# EAGLE design pax_counter (EAGLE 9.6.2)
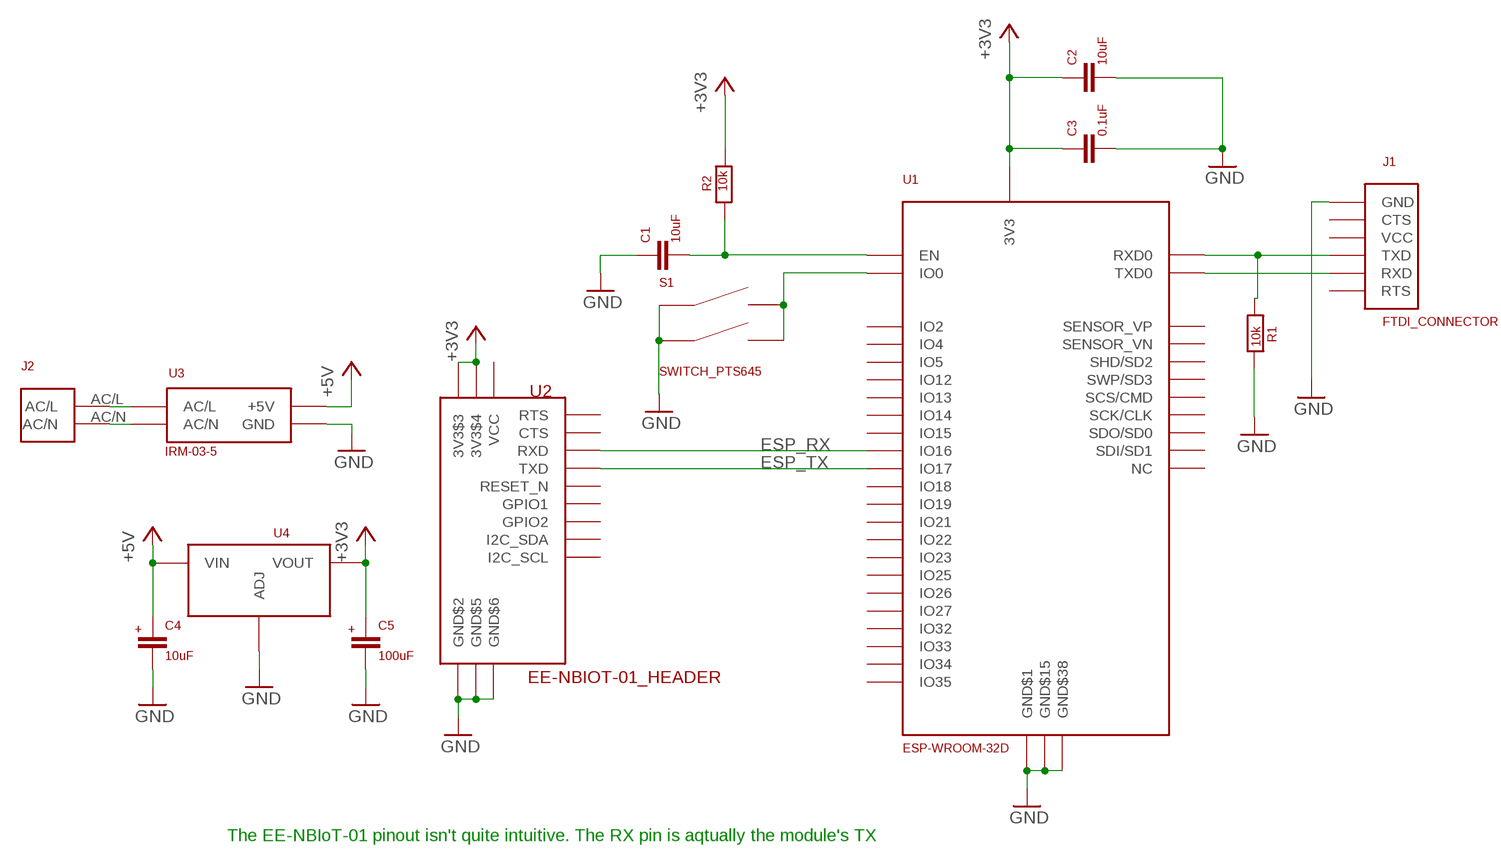
[diagram p0: schematic, sheet 1]

## Parts
C1  10uF  CAPACITOR0402  [CAP_0402]
C2  10uF  CAPACITOR0402  [CAP_0402]
C3  0.1uF  CAPACITOR0402  [CAP_0402]
C4  10uF  TANTALUM_CAPACITOR  [TANTALUM_CAP_1206]
C5  100uF  TANTALUM_CAPACITOR  [TANTALUM_CAP_1206]
J1  FTDI_CONNECTOR  [FTDI_CONNECTOR]
J2  240VAC_SOLDER_CONNECTOR  [240VAC_SOLDER_CONNECTOR]
R1  10k  RESISTOR  [RES_0402]
R2  10k  RESISTOR  [RES_0402]
S1  SWITCH_PTS645  [SWITCH_PTS645_EE_NBIOT_01]
U1  ESP-WROOM-32D  [ESP_WROOM_32D]
U2  EE-NBIOT-01_HEADER  [EE-NBIOT-01_HEADER]
U3  IRM-03-5  [IRM-03-5]
U4  LM1117  [SOT-223]

## Nets
+3V3: C2.P$1 C3.P$1 C5.V+(+) R2.P$2 U1.2(3V3) U2.3V3$3 U2.3V3$4 U4.P$2(VOUT) U4.VOUT$1(VOUT)
+5V: C4.V+(+) U3.+5V U4.VIN
ESP_RX: U1.27(IO16) U2.RXD
ESP_TX: U1.28(IO17) U2.TXD
GND: C1.P$1 C2.P$2 C3.P$2 C4.GND(-) C5.GND(-) J1.GND R1.P$2 S1.A1 S1.A2 U1.1(GND$1) U1.15(GND$15) U1.38(GND$38) U1.GND$39(GND$38) U1.GND$40(GND$38) U1.GND$41(GND$38) U1.GND$42(GND$38) U1.GND$43(GND$38) U1.GND$44(GND$38) U1.GND$45(GND$38) U1.GND$46(GND$38) U1.GND$47(GND$38) U2.GND$2 U2.GND$5 U2.GND$6 U3.GND U4.GND(ADJ)
N$1: J2.AC/L U3.AC/L
N$2: J2.AC/N U3.AC/N
N$3: C1.P$2 R2.P$1 U1.3(EN)
N$4: J1.TXD R1.P$1 U1.34(RXD0)
N$5: J1.RXD U1.35(TXD0)
N$6: S1.B1 S1.B2 U1.25(IO0)
Unconnected: J1.CTS J1.RTS J1.VCC U1.4(SENSOR_VP) U1.5(SENSOR_VN) U1.6(IO34) U1.7(IO35) U1.8(IO32) U1.9(IO33) U1.10(IO25) U1.11(IO26) U1.12(IO27) U1.13(IO14) U1.14(IO12) U1.16(IO13) U1.17(SHD/SD2) U1.18(SWP/SD3) U1.19(SCS/CMD) U1.20(SCK/CLK) U1.21(SDO/SD0) U1.22(SDI/SD1) U1.23(IO15) U1.24(IO2) U1.26(IO4) U1.29(IO5) U1.30(IO18) U1.31(IO19) U1.32(NC) U1.33(IO21) U1.36(IO22) U1.37(IO23) U2.CTS U2.GPIO1 U2.GPIO2 U2.I2C_SCL U2.I2C_SDA U2.RESET_N U2.RTS U2.VCC

## Notes on the sheet
- The EE-NBIoT-01 pinout isn't quite intuitive. The RX pin is aqtually the module's TX

## Library data of the parts
C1-C3 = TimeExpander2:CAPACITOR
C4 C5 = TimeExpander2:TANTALUM_CAPACITOR
J1 = TimeExpander2:FTDI_CONNECTOR
J2 = TimeExpander2:240VAC_SOLDER_CONNECTOR
R1 R2 = TimeExpander2:RESISTOR
S1 = TimeExpander2:SWITCH_PTS645
U1 = TimeExpander2:ESP-WROOM-32D
U2 = TimeExpander2:EE-NBIOT-01_HEADER
U3 = TimeExpander2:IRM-03-5
U4 = TimeExpander2:LM1117

## Board
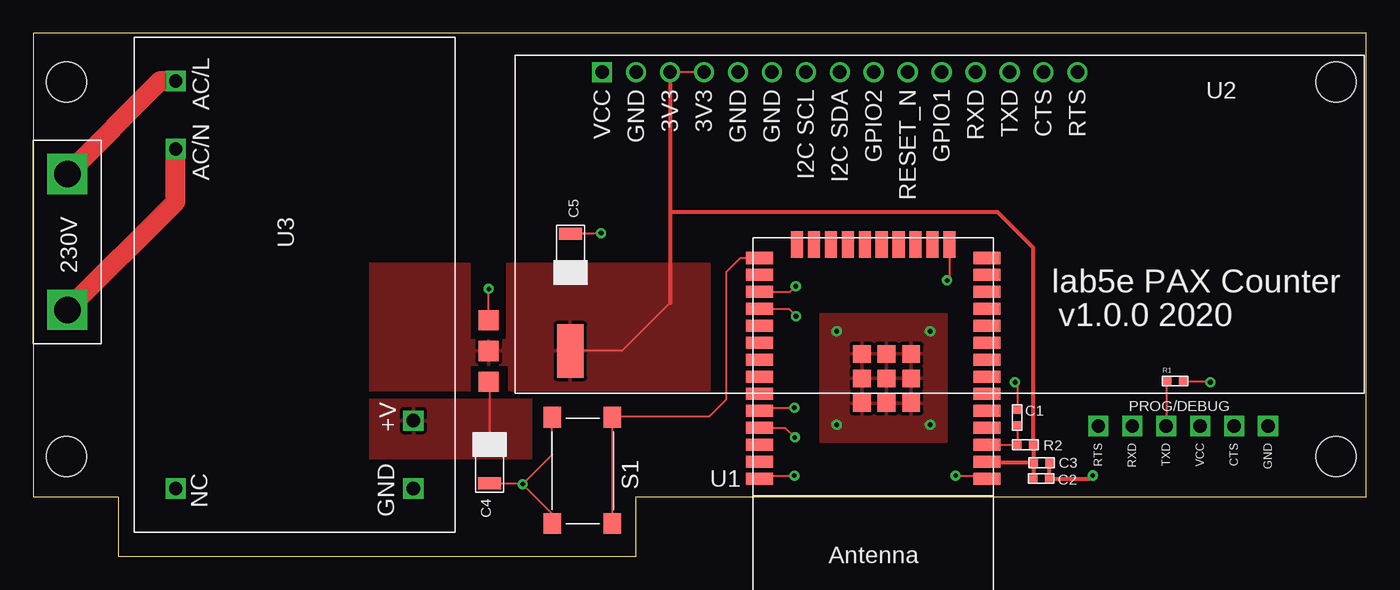
[diagram p1: board, top side]
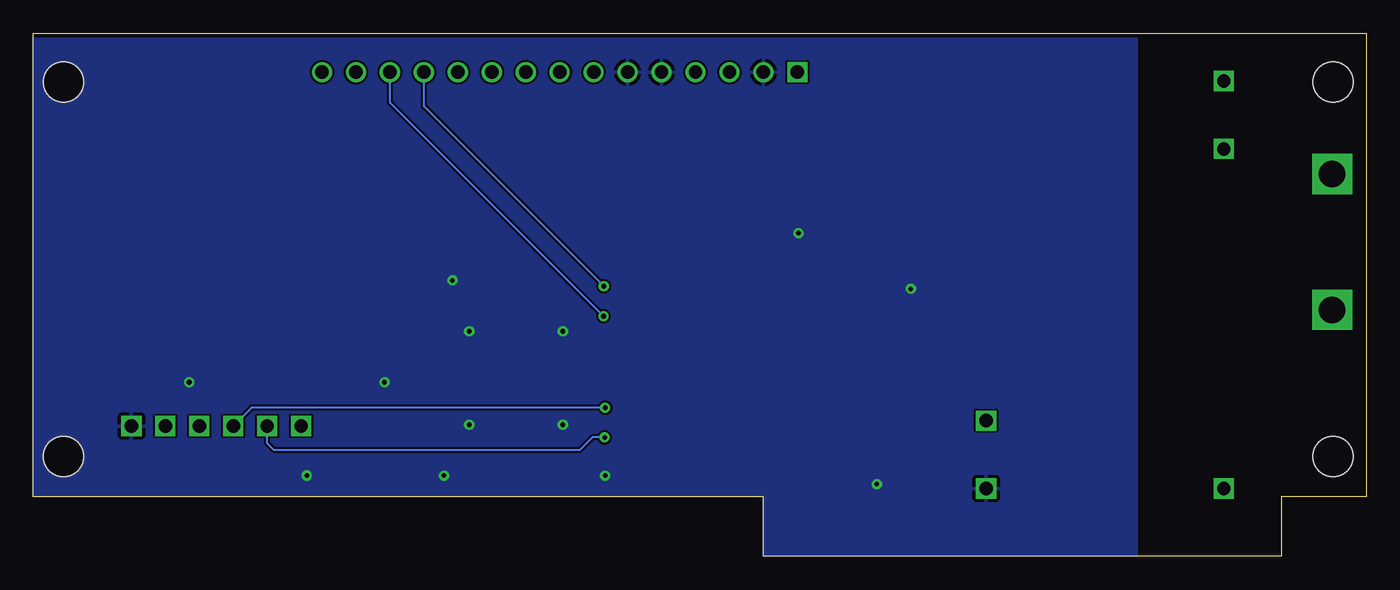
[diagram p2: board, bottom side, seen from below]

Size 99.69 x 39.09 mm. Coordinates in mm from the lower left corner, seen from the top.
Outline: 0,4.44 6.35,4.44 6.35,0 45.08,0 45.08,4.44 99.69,4.44 99.69,39.09 0,39.09 0,4.44
Copper layers (1*16): Top 0.035mm / dielectric 1.5mm / Bottom 0.035mm
Design rules "default *": minimum track width 6mil, minimum drill 0.35mm, track to track 6mil, track to pad 6mil, pad to pad 6mil, via to via 6mil, smd to smd 6mil, copper to edge 0mil, drill to drill 6mil, minimum pad ring 10mil, minimum via ring 8mil, stop-mask expansion 4mil, vias tented up to drill 20mil, thermal gap 10mil
Holes 3 mm at 2.46,7.44 97.46,7.44 2.46,35.45 97.46,35.45

### Footprints (pad centres in the part's own frame; a part is rotated, then mirrored left to right if it is on the bottom)
CAP_0402 = smd 0.635 x 0.61: P$1 0,0; P$2 1.194,0
TANTALUM_CAP_1206 = smd 0.914 x 1.72: GND 0,0; V+ 3.048,0
FTDI_CONNECTOR = drill 1 square: CTS 2.54,0; GND 0,0; RTS 12.7,0; RXD 10.16,0; TXD 7.62,0; VCC 5.08,0
240VAC_SOLDER_CONNECTOR = drill 2 square: AC/L 0,0; AC/N 10.16,0
RES_0402 = smd 0.635 x 0.61: P$1 0,0; P$2 1.194,0
SWITCH_PTS645_EE_NBIOT_01 = smd 1.55 x 1.3: A1 0,0; A2 7.95,0; B1 0,-4.5; B2 7.95,-4.5
ESP_WROOM_32D = smd 2 x 0.9: 1 0,16.51; 2 0,15.24; 3 0,13.97; 4 0,12.7; 5 0,11.43; 6 0,10.16; 7 0,8.89; 8 0,7.62; 9 0,6.35; 10 0,5.08; 11 0,3.81; 12 0,2.54; 13 0,1.27; 14 0,0; 25 17,0; 26 17,1.27; 27 17,2.54; 28 17,3.81; 29 17,5.08; 30 17,6.35; 31 17,7.62; 32 17,8.89; 33 17,10.16; 34 17,11.43; 35 17,12.7; 36 17,13.97; 37 17,15.24; 38 17,16.51 | smd 0.9 x 2: 15 2.785,-1; 16 4.055,-1; 17 5.325,-1; 18 6.595,-1; 19 7.865,-1; 20 9.135,-1; 21 10.405,-1; 22 11.675,-1; 23 12.945,-1; 24 14.215,-1 | smd 1.33 x 1.33: GND$39 5.665,10.845; GND$40 7.5,10.845; GND$41 9.335,10.845; GND$42 5.665,9.01; GND$43 7.5,9.01; GND$44 9.335,9.01; GND$45 5.665,7.175; GND$46 7.5,7.175; GND$47 9.335,7.175
EE-NBIOT-01_HEADER = drill 1: 3V3$3 0,5.08; 3V3$4 0,7.62; CTS 0,33.02; GND$2 0,2.54; GND$5 0,10.16; GND$6 0,12.7; GPIO1 0,25.4; GPIO2 0,20.32; I2C_SCL 0,15.24; I2C_SDA 0,17.78; RESET_N 0,22.86; RTS 0,35.56; RXD 0,27.94; TXD 0,30.48 | drill 1 square: VCC 0,0
IRM-03-5 = drill 1 square: +5V 25.4,17.78; AC/L 0,0; AC/N 5.08,0; GND 30.48,17.78; NC 30.48,0
SOT-223 = smd 1.5 x 1.5: GND -2.3,-6.1; P$2 0,-6.1; VIN 2.3,-6.1 | smd 4 x 2: VOUT$1 0,0

### Placement (x,y rotation side)
C1  73.6,10.97 270 top
C2  74.79,5.8 0 top
C3  74.82,6.98 0 top
C4  34.11,5.45 90 top
C5  40.18,24.1 270 top
J1  92.37,9.73 180 top
J2  2.54,28.57 270 top
R1  84.8,13.09 0 top
R2  73.61,8.33 0 top
S1  38.81,2.44 90 top
U1  71.32,22.3 180 top
U2  42.55,36.2 270 top
U3  10.64,35.53 270 top
U4  40.16,15.34 270 top

### Tracks (layer width: path | path; a pad name or v marks a point on that pad's centre or on a via)
+3V3
  Top 0.152: U4.VOUT$1 44.02,15.34 47.62,18.95 | 71.39,6.98 U1.2 | 74.82,5.83 C2.P$1 | R2.P$2 74.82,8.32 | U2.3V3$4 U2.3V3$3
  Top 0.3: U2.3V3$3 47.62,25.7 | 47.62,25.7 47.62,18.95 | C3.P$1 71.39,6.98 | C3.P$1 74.82,5.83 | 74.82,8.32 C3.P$1 | R2.P$2 74.8,23.06 72.16,25.7 47.62,25.7
  pour Top: 35.6,14.27 32.64,14.27 32.64,12.37 25.17,12.37 25.17,21.89 32.61,21.89 32.61,16.18 35.45,16.18 35.45,21.89 50.57,21.89 50.57,12.37 35.6,12.37
+5V
  Top 0.152: U4.VIN 34.11,12.99 C4.V+
  pour Top: 25.17,11.73 37.24,11.73 37.24,7.29 25.17,7.29
ESP_RX  (via drill 0.35)
  Top 0.152: U1.27 56.6,19.76 v57.02,20.18
  Bottom 0.152: v57.02,20.18 70.48,33.64 U2.RXD
ESP_TX  (via drill 0.35)
  Top 0.152: U1.28 56.51,18.49 v57.05,17.94
  Bottom 0.152: v57.05,17.94 73.02,33.92 U2.TXD
GND  (via drill 0.35)
  Top 0.152: C4.GND 36.54,5.45 v36.6,5.38 | v36.6,5.38 38.81,3.17 S1.A1 | v36.6,5.38 38.81,7.59 S1.A2 | U4.GND v34.06,19.99 | C5.GND 40.23,24.16 v42.46,24.16 | v68.99,6.02 71.09,6.02 U1.1 | 75.98,6.96 C3.P$2 | U1.38 54.56,6.02 v56.92,6.02 | R1.P$2 87.95,13.09 v88.04,13 | U1.15 68.54,20.81 v68.35,20.62 | v73.43,13 73.6,12.84 C1.P$1
  Top 0.3: 75.98,6.96 C2.P$2 79.02,5.8 v79.25,6.03
  other vias: 60.1,16.81 67.08,16.81 67.08,9.83 60.1,9.83
  pour Bottom: 17.14,38.73 17.14,0 45.09,0 45.09,4.44 99.69,4.44 99.69,38.73
  pour Top: 58.83,18.08 58.83,8.56 68.35,8.56 68.35,18.08
N$1
  Top 1.5: J2.AC/L 9.5,35.53 U3.AC/L
N$2
  Top 1.5: J2.AC/N 10.64,26.52 U3.AC/N
N$3
  Top 0.152: C1.P$2 73.6,8.34 R2.P$1 U1.3
N$4  (via drill 0.35)
  Top 0.152: J1.TXD 84.8,9.78 R1.P$1 | U1.34 54.56,11.1 v56.92,11.1
  Bottom 0.152: v56.92,11.1 83.38,11.1 J1.TXD
N$5  (via drill 0.35)
  Top 0.152: U1.35 56.24,9.6 v56.96,8.88
  Bottom 0.152: v56.96,8.88 57.87,8.88 58.83,7.92 81.69,7.92 82.21,8.45 J1.RXD
N$6
  Top 0.152: U1.25 52.88,22.3 51.84,21.26 51.84,11.73 50.57,10.46 43.39,10.46 S1.B2 S1.B1

### Text on the board
tPlace: lab5e PAX Counter | v1.0.0 2020